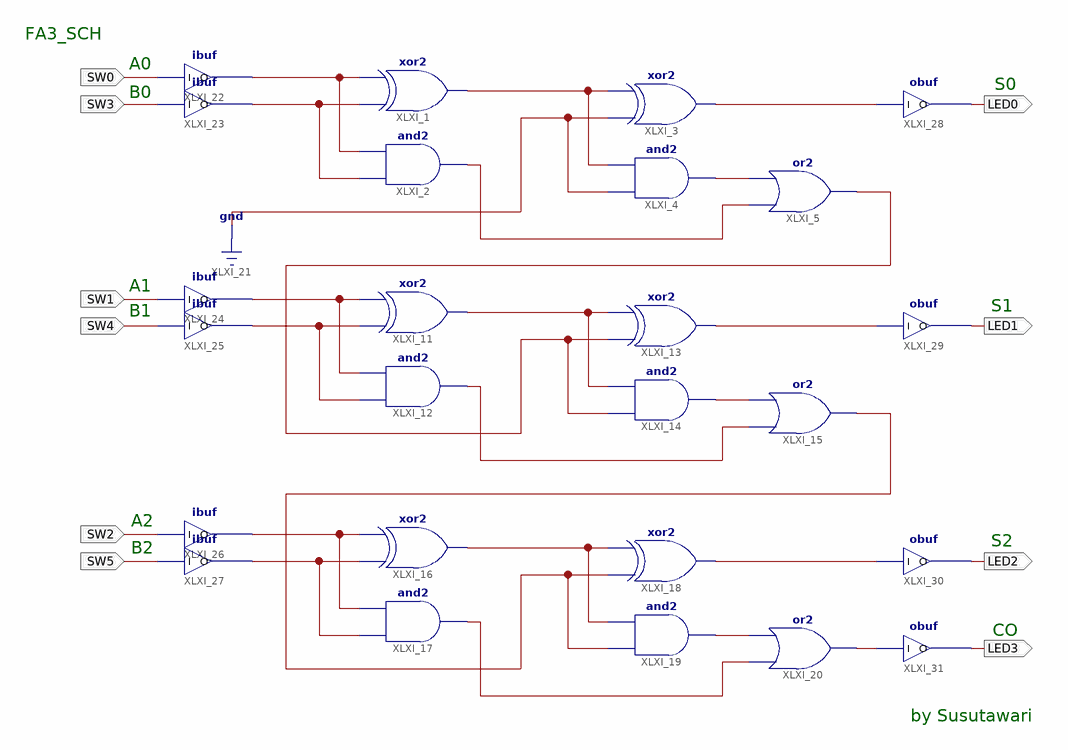
[diagram p0: schematic sheet 1]
// Xilinx ISE schematic FA3_SCH.sch (spartan3a) as structural Verilog: 25 symbols, 10 ports
module FA3_SCH (
  input  SW0,
  input  SW3,
  input  SW1,
  input  SW4,
  input  SW2,
  input  SW5,
  output LED0,
  output LED1,
  output LED2,
  output LED3
);

  wire XLXN_2, XLXN_4, XLXN_5, XLXN_7, XLXN_8, XLXN_16, XLXN_17, XLXN_18, XLXN_20, XLXN_21, XLXN_22, XLXN_23,
       XLXN_24, XLXN_25, XLXN_27, XLXN_28, XLXN_29, XLXN_31, XLXN_32, XLXN_33, XLXN_34;

  xor XLXI_1 (XLXN_5, XLXN_4, XLXN_2);
  and XLXI_2 (XLXN_8, XLXN_4, XLXN_2);
  xor XLXI_3 (XLXN_34, 1'b0, XLXN_5);
  and XLXI_4 (XLXN_7, 1'b0, XLXN_5);
  or XLXI_5 (XLXN_20, XLXN_8, XLXN_7);
  xor XLXI_11 (XLXN_18, XLXN_17, XLXN_16);
  and XLXI_12 (XLXN_22, XLXN_17, XLXN_16);
  xor XLXI_13 (XLXN_33, XLXN_20, XLXN_18);
  and XLXI_14 (XLXN_21, XLXN_20, XLXN_18);
  or XLXI_15 (XLXN_27, XLXN_22, XLXN_21);
  xor XLXI_16 (XLXN_25, XLXN_24, XLXN_23);
  and XLXI_17 (XLXN_29, XLXN_24, XLXN_23);
  xor XLXI_18 (XLXN_32, XLXN_27, XLXN_25);
  and XLXI_19 (XLXN_28, XLXN_27, XLXN_25);
  or XLXI_20 (XLXN_31, XLXN_29, XLXN_28);
  ibuf XLXI_22 (.I(SW0), .O(XLXN_2));
  ibuf XLXI_23 (.I(SW3), .O(XLXN_4));
  ibuf XLXI_24 (.I(SW1), .O(XLXN_16));
  ibuf XLXI_25 (.I(SW4), .O(XLXN_17));
  ibuf XLXI_26 (.I(SW2), .O(XLXN_23));
  ibuf XLXI_27 (.I(SW5), .O(XLXN_24));
  obuf XLXI_28 (.I(XLXN_34), .O(LED0));
  obuf XLXI_29 (.I(XLXN_33), .O(LED1));
  obuf XLXI_30 (.I(XLXN_32), .O(LED2));
  obuf XLXI_31 (.I(XLXN_31), .O(LED3));

  // Notes on the sheet:
  //   FA3_SCH
  //   A0
  //   S0
  //   B0
  //   A1
  //   S1
  //   B1
  //   A2
  //   S2
  //   B2
  //   CO
  //   by Susutawari
endmodule
